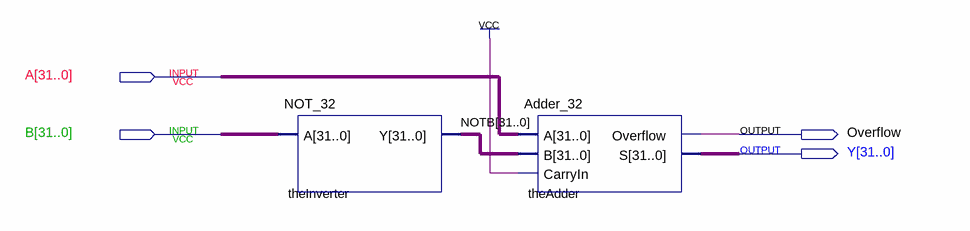
[diagram p0: schematic sheet]
// Quartus schematic Subtractor_32.bdf as structural Verilog: 2 symbols, 4 pins
module Subtractor_32 (
  input  [31:0] A,
  input  [31:0] B,
  output Overflow,
  output [31:0] Y
);

  wire [31:0] NOTB;

  NOT_32 theInverter (.A(B), .Y(NOTB));
  Adder_32 theAdder (.A(A), .B(NOTB), .CarryIn(1'b1), .Overflow(Overflow), .S(Y));
endmodule
